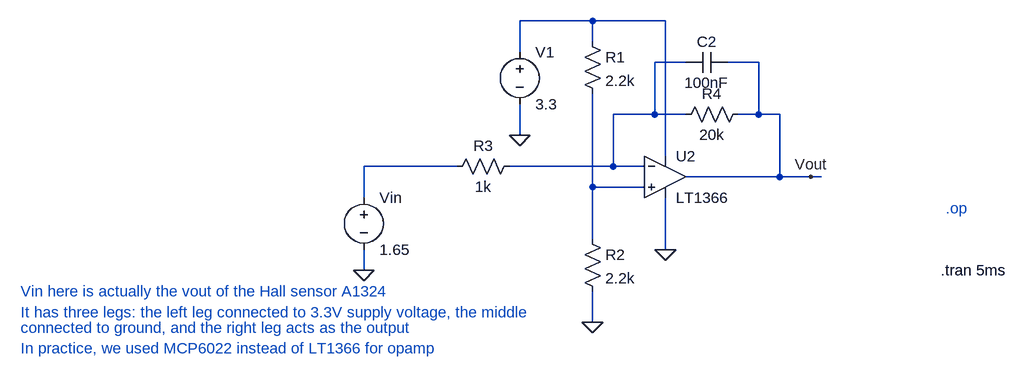
[diagram p0: schematic hall sensor opamp amplify.asc]
hall sensor opamp amplify.asc, the LTspice schematic file:
Version 4.1
SHEET 1 880 680
WIRE 48 -80 -64 -80
WIRE 160 -80 48 -80
WIRE 48 -48 48 -80
WIRE -64 -32 -64 -80
WIRE 192 -16 144 -16
WIRE 304 -16 256 -16
WIRE 144 64 144 -16
WIRE 144 64 80 64
WIRE 192 64 144 64
WIRE 304 64 304 -16
WIRE 304 64 272 64
WIRE 336 64 304 64
WIRE -64 96 -64 48
WIRE 160 128 160 -80
WIRE -160 144 -304 144
WIRE 80 144 80 64
WIRE 80 144 -80 144
WIRE 128 144 80 144
WIRE 336 160 336 64
WIRE 336 160 192 160
WIRE 384 160 336 160
WIRE 400 160 384 160
WIRE 48 176 48 32
WIRE 128 176 48 176
WIRE -304 192 -304 144
WIRE 48 256 48 176
WIRE 160 272 160 192
WIRE -304 304 -304 272
WIRE 48 384 48 336
FLAG -64 96 0
FLAG 48 384 0
FLAG -304 304 0
FLAG 160 272 0
FLAG 384 160 Vout
SYMBOL voltage -64 -48 R0
WINDOW 123 0 0 Left 0
WINDOW 39 0 0 Left 0
SYMATTR InstName V1
SYMATTR Value 3.3
SYMBOL res 32 -64 R0
SYMATTR InstName R1
SYMATTR Value 2.2k
SYMBOL res 32 240 R0
SYMATTR InstName R2
SYMATTR Value 2.2k
SYMBOL voltage -304 176 R0
WINDOW 123 0 0 Left 0
WINDOW 39 0 0 Left 0
SYMATTR InstName Vin
SYMATTR Value 1.65
SYMBOL res -64 128 R90
WINDOW 0 0 56 VBottom 2
WINDOW 3 32 56 VTop 2
SYMATTR InstName R3
SYMATTR Value 1k
SYMBOL res 288 48 R90
WINDOW 0 0 56 VBottom 2
WINDOW 3 32 56 VTop 2
SYMATTR InstName R4
SYMATTR Value 20k
SYMBOL OpAmps\\LT1366 160 96 R0
SYMATTR InstName U2
SYMBOL cap 256 -32 R90
WINDOW 0 0 32 VBottom 2
WINDOW 3 32 32 VTop 2
SYMATTR InstName C2
SYMATTR Value 100nF
TEXT 592 208 Left 2 ;.op
TEXT 584 304 Left 2 !.tran 5ms
TEXT -832 336 Left 2 ;Vin here is actually the vout of the Hall sensor A1324
TEXT -832 368 Left 2 ;It has three legs: the left leg connected to 3.3V supply voltage, the middle
TEXT -832 392 Left 2 ;connected to ground, and the right leg acts as the output
TEXT -832 424 Left 2 ;In practice, we used MCP6022 instead of LT1366 for opamp

The netlist it stands for:
* hall sensor opamp amplify.asc
V1 N001 0 3.3
R1 N001 N004 2.2k
R2 N004 0 2.2k
Vin N003 0 1.65
R3 N002 N003 1k
R4 Vout N002 20k
X§U2 N004 N002 N001 0 Vout LT1366  ; pins In+ In- V+ V- OUT
C2 Vout N002 100nF
* .op
.tran 5ms
* Vin here is actually the vout of the Hall sensor A1324
* It has three legs: the left leg connected to 3.3V supply voltage, the middle
* connected to ground, and the right leg acts as the output
* In practice, we used MCP6022 instead of LT1366 for opamp
.lib LTC.lib
.backanno
.end